# EAGLE design Lumen (EAGLE 7.4.0)
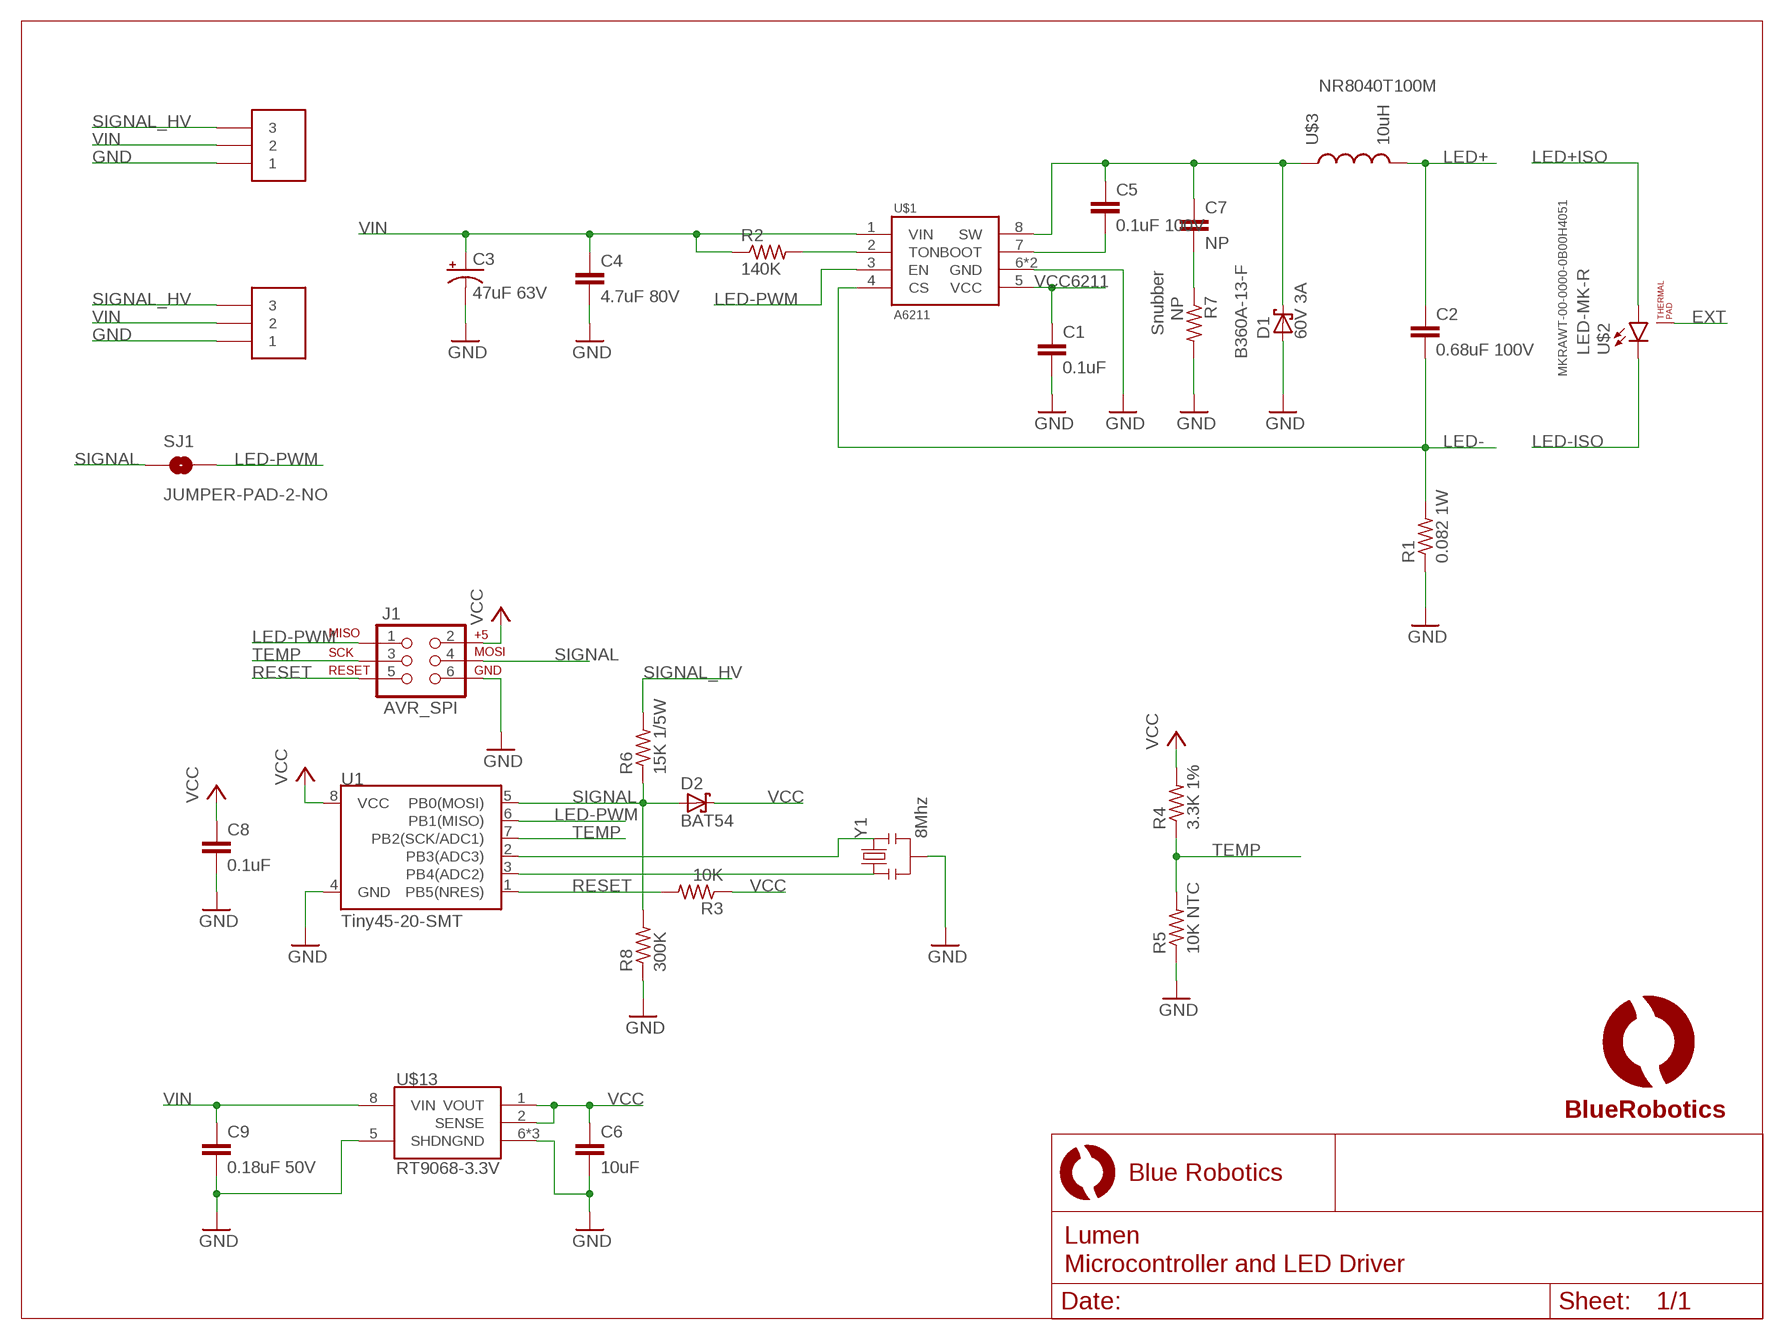
[diagram p0: schematic, sheet 1]

## Parts
C1  0.1uF  C-EUC0603  [C0603]
C2  0.68uF 100V  C-EUC0805  [C0805]
C3  47uF 63V  CAP_POLPTH1  [CPOL-RADIAL-100UF-25V]
C4  4.7uF 80V  C-EUC1210  [C1210]
C5  0.1uF 100V  C-EUC0805  [C0805]
C6  10uF  C-EUC0603  [C0603]
C7  NP  C-EUC0603  [C0603]
C8  0.1uF  C-EUC0603  [C0603]
C9  0.18uF 50V  C-EUC0805  [C0805]
D1  60V 3A  DIODE-SCHOTTKYSMA  [SMA]
D2  BAT54  DIODE-SCHOTTKYSOD523  [SOD523]
J1  AVR_SPI  AVR_SPI_PRG_6PTH  [2X3]
R1  0.082 1W  R-US_R2512  [R2512]
R2  140K  R-US_R0603  [R0603]
R3  10K  R-US_R0603  [R0603]
R4  3.3K 1%  R-US_R0603  [R0603]
R5  10K NTC  R-US_R0603  [R0603]
R6  15K 1/5W  RESISTOR_0402  [R0402]
R7  NP  R-US_R1206  [R1206]
R8  300K  RESISTOR_0402  [R0402]
SJ1  JUMPER-PAD-2-NO  [PAD-JUMPER-2-NO_NO_SILK]
U1  Tiny45-20-SMT  ATTINY45TINY45-20-SMT  [SO08-EIAJ]
U$1  A6211  [SOIC8N-LJ]
U$2  LED-MK-R  [MK-R]
U$3  10uH  INDUCTOR8040  [INDUCTOR-8040]
U$10  LOGOBR-LOGO-MS-COPPER  [BR-LOGO-MEDIUM-SMALL-COPPER]
U$11  009176003032006  HEADER-3AVX-9176  [AVX-9176-3POS]
U$12  009176003032006  HEADER-3AVX-9176  [AVX-9176-3POS]
U$13  RT9068-3.3V  VREG-RT9068SOP-8  [SOIC8N-LJ]
Y1  8Mhz  RESONATORSMD  [RESONATOR-SMD]

## Nets
EXT: U$2.EXP(THERMAL)
GND: C1.2 C3.2(-) C4.2 C6.2 C8.2 C9.2 D1.A J1.6 R1.1 R5.1 R7.2 R8.1 U1.4(GND) U$1.6(GND) U$1.PAD(GND) U$11.1 U$12.1 U$13.5(SHDN) U$13.6(GND) U$13.7(GND) U$13.PAD(GND) Y1.2
LED+: C2.1 U$3.P$2
LED+ISO: U$2.A
LED-: C2.2 R1.2 U$1.4(CS)
LED-ISO: U$2.C
LED-PWM: J1.1 SJ1.2 U1.6(PB1(MISO)) U$1.3(EN)
N$1: R2.2 U$1.2(TON)
N$2: C7.2 R7.1
N$4: C5.2 U$1.7(BOOT)
N$5: C5.1 C7.1 D1.C U$1.8(SW) U$3.P$1
N$6: U1.3(PB4(ADC2)) Y1.1
N$7: U1.2(PB3(ADC3)) Y1.3
RESET: J1.5 R3.2 U1.1(PB5(NRES))
SIGNAL: D2.A J1.4 R6.1 R8.2 SJ1.1 U1.5(PB0(MOSI))
SIGNAL_HV: R6.2 U$11.3 U$12.3
TEMP: J1.3 R4.1 R5.2 U1.7(PB2(SCK/ADC1))
VCC: C6.1 C8.1 D2.C J1.2 R3.1 R4.2 U1.8(VCC) U$13.1(VOUT) U$13.2(SENSE)
VCC6211: C1.1 U$1.5(VCC)
VIN: C3.1(+) C4.1 C9.1 R2.1 U$1.1(VIN) U$11.2 U$12.2 U$13.8(VIN)

## Notes on the sheet
- NR8040T100M
- Snubber
- B360A-13-F
- MKRAWT-00-0000-0B00H4051

## Library data of the parts
C1 C2 C4-C9 = resistor:C-EU: CAPACITOR, European symbol
C3 = SparkFun-Capacitors:CAP_POL: Capacitor Polarized These are standard SMD and PTH capacitors. Normally 10uF, 47uF, and 100uF in electrolytic and tantalum varieties. Always verify the external diameter of the through hole cap, it varies with capacity, voltage, and manufacturer. The EIA devices should be standard.
D1 D2 = BlueRobotics-Main:DIODE-SCHOTTKY
J1 = SparkFun-Connectors:AVR_SPI_PRG_6: AVR ISP 6 Pin This is the reduced ISP connector for AVR programming. Common on Arduino. This footprint will take up less PCB space and can be used with a 10-pin to 6-pin adapter such as SKU: BOB-08508 **Special note about "TEST_POINT" package. The stop mask is on the top side, so if you want your programming test points to be on the bottom of your board, make sure to place this package on the bottom side of the board. This also ensure that the orientation to program from the bottom side will be correct.
R1-R5 R7 = resistor:R-US_: RESISTOR, American symbol
R6 R8 = BlueRobotics-Main:RESISTOR
SJ1 = SparkFun-Passives:JUMPER-PAD-2-NO
U1 = SparkFun-DigitalIC:ATTINY45: Atmel 8-pin 2/4/8kB flash uC; PROD_ID: IC-08922
U$1 = BlueRobotics-Main:A6211
U$2 = BlueRobotics-Main:LED-MK-R
U$3 = BlueRobotics-Main:INDUCTOR
U$10 = BlueRobotics-Main:LOGO
U$11 U$12 = BlueRobotics-Main:HEADER-3
U$13 = BlueRobotics-Main:VREG-RT9068: RT9068 60V to 3.3V Regulator, 50mA
Y1 = SparkFun:RESONATOR: Resonator Small SMD resonator. This is the itty bitty 10/20MHz resonators with built in caps. CSTCE10M0G55 and CSTCE20M0V53. Footprint has been reviewed closely but hasn't been tested yet.

## Board
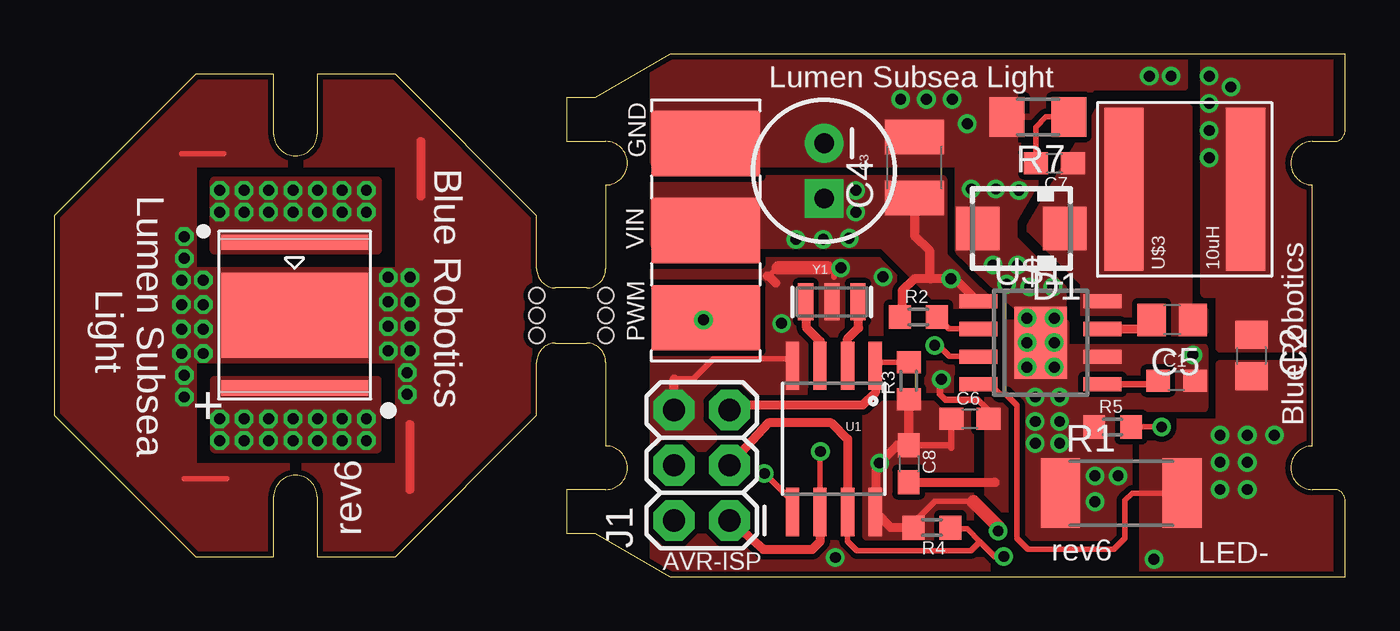
[diagram p1: board, top side]
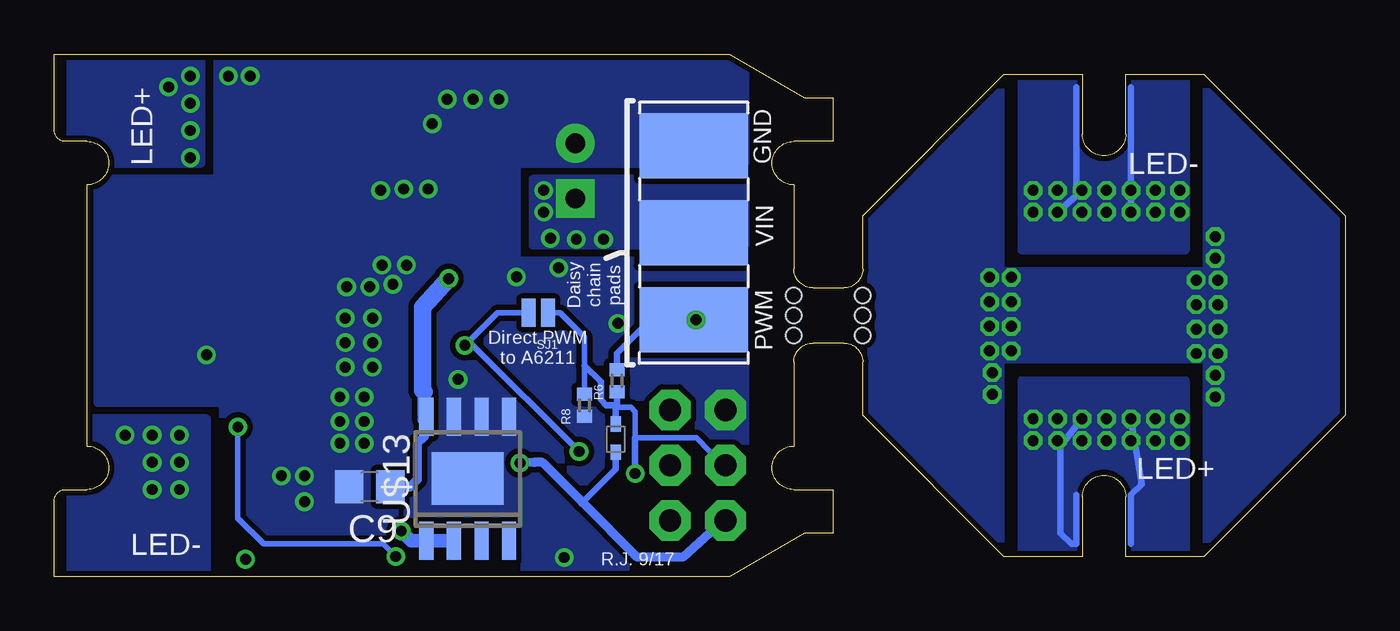
[diagram p2: board, bottom side, seen from below]

Size 59.35 x 24 mm. Coordinates in mm from the lower left corner, seen from the top.
Outline: 57.85,20 58.85,20 arc90 59.35,20.5 59.35,24 28.31,24 24.85,22 23.55,22 23.55,20 25.35,20 arc-180 25.35,18 25.35,14.15 arc-90 24.47,13.27 23.05,13.27 arc-90 22.17,14.15 22.17,16.59 15.68,23.09 12.09,23.09 12.09,20.34 arc-180 10.09,20.34 10.09,23.09 6.49,23.09 0,16.59 0,7.41 6.49,0.91 10.09,0.91 10.09,3.66 arc-180 12.09,3.66 12.09,0.91 15.68,0.91 22.17,7.41 22.17,9.85 arc-90 23.05,10.73 24.47,10.73 arc-90 25.35,9.85 25.35,6 arc-180 25.35,4 23.55,4 23.55,2 24.85,2 28.31,0 59.35,0 59.35,3.5 arc90 58.85,4 57.85,4 arc-180 57.85,6 57.85,18 arc-180 57.85,20
Copper layers (1*16): Top 0.0356mm / dielectric 1.5011mm / Bottom 0.0356mm
Design rules "OSHPark *": minimum track width 6mil, minimum drill 10mil, track to track 6mil, track to pad 6mil, pad to pad 6mil, via to via 6mil, smd to smd 6mil, copper to edge 10mil, drill to drill 6mil, minimum pad ring 7mil, minimum via ring 7mil, stop-mask expansion 3mil, vias tented up to drill 30mil, thermal gap 10mil
Holes 0.7 mm at 25.34,12.92 25.34,12 25.34,11.08 22.17,12.92 22.17,12 22.17,11.08

### Footprints (pad centres in the part's own frame; a part is rotated, then mirrored left to right if it is on the bottom)
C0603 = smd 1.1 x 1: 1 -0.85,0; 2 0.85,0
C0805 = smd 1.3 x 1.5: 1 -0.95,0; 2 0.95,0
CPOL-RADIAL-100UF-25V = drill 0.9 pad 1.778 square: 1 1.27,0 | drill 0.9 pad 1.778: 2 -1.27,0
C1210 = smd 1.6 x 2.7: 1 -1.4,0; 2 1.4,0
SMA = smd 2 x 2: A 2,0; C -2,0
SOD523 = smd 0.7 x 0.5: A 0.7,0; C -0.6,0
2X3 = drill 1.016 pad 1.88 octagon: 1 0,0; 2 0,2.54; 3 2.54,0; 4 2.54,2.54; 5 5.08,0; 6 5.08,2.54
R2512 = smd 1.8 x 3.2: 1 -2.8,0; 2 2.8,0
R0603 = smd 1 x 1.1: 1 -0.85,0; 2 0.85,0
R0402 = smd 0.6 x 0.7: 1 -0.5,0; 2 0.5,0
R1206 = smd 1.6 x 1.803: 1 -1.422,0; 2 1.422,0
PAD-JUMPER-2-NO_NO_SILK = smd 0.635 x 1.27: 1 -0.45,0; 2 0.45,0
SO08-EIAJ = smd 0.61 x 2.21: 1 -1.905,-3.378; 2 -0.635,-3.378; 3 0.635,-3.378; 4 1.905,-3.378; 5 1.905,3.353; 6 0.635,3.353; 7 -0.635,3.353; 8 -1.905,3.353
SOIC8N-LJ = smd 0.65 x 1.75: 1 -1.9,-2.86; 2 -0.63,-2.86; 3 0.64,-2.86; 4 1.91,-2.86; 5 1.91,2.84; 6 0.64,2.84; 7 -0.63,2.84; 8 -1.9,2.84 | smd 3.3 x 2.41: PAD 0,0
MK-R = smd 0.7 x 6.76: A 0,0; C 6.7,0 | smd 3.9 x 6.76: EXP 3.35,0
INDUCTOR-8040 = smd 1.8 x 7.5: P$1 -2.8,0; P$2 2.8,0
AVX-9176-3POS = smd 3 x 5: 1 0,0; 2 4,0; 3 8,0
RESONATOR-SMD = smd 0.7 x 1.7: 1 -1.2,0; 2 0,0; 3 1.2,0

### Placement (x,y rotation side)
C1  51.6,9 0 top
C2  55.04,10.16 270 top
C3  35.39,18.65 270 top
C4  39.55,18.8 90 top
C5  51.4,11.8 180 top
C6  42.1,7.25 0 top
C7  45.97,19 180 top
C8  39.29,5.19 270 top
C9  44.85,4.12 180 bottom
D1  44.46,15.99 180 top
D2  33.54,6.31 90 bottom
J1  31.04,2.58 90 top
R1  49.05,3.83 0 top
R2  39.73,11.93 0 top
R3  39.29,9 90 top
R4  40.35,2.25 180 top
R5  48.66,6.88 0 top
R6  33.47,9 90 bottom
R7  45.22,21.12 180 top
R8  34.97,7.88 90 bottom
SJ1  37.1,12.12 180 bottom
U1  35.84,6.32 180 top
U$1  45.35,10.75 270 top
U$2  11.05,15.37 270 top
U$3  51.97,17.8 0 top
U$10  49.97,12.75 90 bottom
U$11  29.95,19.9 270 top
U$12  29.95,19.8 270 bottom
U$13  40.35,4.5 0 bottom
Y1  35.75,12.62 0 top

### Tracks (layer width: path | path; a pad name or v marks a point on that pad's centre or on a via)
EXT  (via drill 0.5)
  Top 0.254: 7.91,4.5 5.97,4.5 | 7.79,19.44 5.85,19.44
  Top 0.406: 16.85,20 16.85,17.5 | 16.35,4 16.35,7
  other vias: 15.35,10.38 15.35,11.5 15.35,12.62 6.85,13.62 6.85,12.5 6.85,11.38 15.35,13.75 6.85,10.25 16.35,10.38 16.35,11.5 16.35,12.62 16.35,13.75 5.85,13.62 5.85,12.5 5.85,11.38 5.85,10.25 5.97,9.25 5.97,8.25 5.97,14.62 5.97,15.62 16.22,9.38 16.22,8.38
  pour Top (isolate 0.254, no thermals): 22.35,24 15.85,24 15.85,14 6.35,14 6.35,24 -2.15,24 -2.15,-1 6.35,-1 6.35,10 15.85,10 15.85,-1 22.35,-1
  pour Top (isolate 0.254, no thermals): 17.85,19 2.85,19 2.85,24 17.85,24
  pour Top (isolate 0.254, no thermals): 17.85,5 2.85,5 2.85,0 17.85,0
  pour Bottom (isolate 0.254, no thermals): 21.85,-1 15.85,-1 15.85,10 6.35,10 6.35,-1 -2.15,-1 -2.15,24 6.35,24 6.35,14 15.85,14 15.85,24 21.85,24
GND  (via drill 0.5)
  Top 0.254: 35.85,13.77 35.85,14 35.54,14.19 | 33.29,14.19 32.79,13.81 | 28.5,9.09 29.39,9.09 30.3,10 33.63,10 U1.4
  Top 0.305: C6.2 42.95,7.65 42.47,8.12 40.97,8.12 40.72,8.38 40.72,9 v40.79,9.06
  Top 0.406: J1.6 28.5,9.09 | 32.79,13.81 32.85,13.81 33.16,13.5 | C8.2 43.23,4.34 43.25,4.32
  Top 0.61: 35.54,14.19 33.29,14.19
  other vias: 38.91,21.94 41.97,20.81 40.1,21.94 41.29,21.94 42.16,17.81 43.29,17.81 38.1,13.77 47.85,3.44 52.35,10.19 44.85,13.31 45.91,13.31 47.85,4.62 35.91,0.88 36.16,14.19 48.91,4.62 46.22,6.12 44.35,17.75 50.35,23 51.35,23 44.72,9.62 44.72,10.75 44.72,11.88 45.97,11.88 45.97,10.75 45.97,9.62 46.22,8.25 46.22,7.12 44.29,14.31 43.16,14.31 43.79,13.44 45.1,8.25 45.1,7.12 45.1,6.12 33.43,11.64
  pour Top (isolate 0.254, no thermals): 27.6,25 44.1,25 44.1,19 27.6,19
  pour Top (isolate 0.254, no thermals): 41.6,20 41.6,15 44.35,12.38 46.35,10.25 46.35,13.25 44.1,15.5 44.1,20
  pour Bottom (isolate 0.254, no thermals): 27.6,19 27.6,25 51.85,25 51.85,18.25 57.35,18.25 57.35,8 51.6,8 51.6,-0.75 27.6,-0.75 27.6,14.5 38.1,14.5 38.1,19
  pour Top (isolate 0.254): 43.47,15.25 47.72,22.5 51.97,22.5 51.97,25 44.1,25
  pour Top (isolate 0.254, no thermals): 27.6,14.5 37.85,14.5 40.72,11.62 46.47,11.62 46.47,10.5 52.85,10.5 52.85,7.75 49.35,7.75 49.35,0 42.97,0 42.97,8.62 36.47,8.62 36.47,0 27.6,0
  pour Top (isolate 0.254, no thermals): 35.22,1.12 44.1,1.12 44.1,-0.62 35.22,-0.62
LED+  (via drill 0.5)
  other vias: 53.1,23 54.1,22.5 53.1,21.75 53.1,20.5 53.1,19.25
  pour Top (isolate 0.254, no thermals): 52.9,25 58.6,25 58.6,20 57.85,20 57.85,10.5 53.6,10.5 53.6,13 52.9,13
  pour Bottom (isolate 0.254, no thermals): 52.6,25 58.6,25 58.6,19 52.6,19
LED+ISO  (via drill 0.5)
  Bottom 0.305: 9.85,22.5 v9.85,16.75 | 12.35,22.5 12.35,17.5 v13.22,16.75
  other vias: 14.35,16.75 12.1,16.75 10.97,16.75 8.72,16.75 7.6,16.75 14.35,17.75 13.22,17.75 12.1,17.75 10.97,17.75 9.85,17.75 8.72,17.75 7.6,17.75
  pour Top (isolate 0.254, no thermals): 14.85,15 7.35,15 7.35,18.19 14.85,18.19
  pour Bottom (isolate 0.254, no thermals): 14.85,23.75 7.35,23.75 7.35,15 14.85,15
LED-  (via drill 0.5, 0.5 pad 0.25)
  Top 0.254: R1.2 49.56,3.83 49.22,3.5 49.22,1.75 48.72,1.25 44.76,1.25 44.26,1.75 44.26,7.88 43.76,8.38 43.47,8.38 43.01,8.84 U$1.4 | 42.47,8.82 U$1.4 | 42.6,8.73 U$1.4
  other vias: 54.85,4 53.6,4 53.6,5.25 53.6,6.5 54.85,6.5 54.85,5.25 56.1,6.5 50.56,0.79
  pour Bottom (isolate 0.254, no thermals): 58.6,-0.5 52.35,-0.5 52.35,7.25 58.6,7.25
  pour Top (isolate 0.254, no thermals): 53.6,9.75 58.6,9.75 58.6,-0.5 50.1,-0.5 50.1,7.06 53.6,7.06
LED-ISO  (via drill 0.5)
  Bottom 0.305: 12.35,3.75 12.35,1.5 12.6,1.5 13.1,2 13.1,6 v12.1,7.25 | 9.85,1.5 9.85,3.75 9.35,4.25 v9.85,7.25
  other vias: 14.35,7.25 13.22,7.25 10.97,7.25 8.72,7.25 7.6,7.25 7.6,6.25 8.72,6.25 9.85,6.25 10.97,6.25 12.1,6.25 13.22,6.25 14.35,6.25
  pour Top (isolate 0.254, no thermals): 14.85,9 7.35,9 7.35,5.88 14.85,5.88
  pour Bottom (isolate 0.254, no thermals): 7.35,9 7.35,-1 14.85,-1 14.85,9
LED-PWM  (via drill 0.5)
  Top 0.254: U1.6 35.2,5.83 v35.22,5.75 | v40.47,10.62 40.6,10.69 41.16,10.12 42.47,10.12 U$1.3
  Top 0.406: J1.1 31.36,2.33 32.6,1.25 34.85,1.25 35.22,1.62 35.22,2.95 U1.6
  Bottom 0.254: v35.22,5.75 40.16,10.69 40.79,10.69 v40.47,10.62 38.97,12.12 SJ1.2
N$1
  Top 0.254: U$1.2 41.13,11.38 R2.2
N$2
  Top 0.254: C7.2 45.12,20.65 45.6,21.12 R7.1
N$4
  Top 0.406: U$1.7 50.63,11.38 C5.2
N$5
  pour Top (isolate 0.254, no thermals): 52.85,11.25 52.85,12.25 52.15,12.25 52.15,21.5 48.1,21.5 44.85,16 47.35,13.5 47.35,11.25
N$6
  Top 0.406: U1.3 35.2,10.82 34.59,11.43 34.59,12.58 Y1.1
N$7
  Top 0.406: U1.2 36.47,10.93 36.97,11.43 36.97,12.6 Y1.3
RESET
  Top 0.254: R3.2 37.9,9.85 U1.1
  Top 0.406: U1.1 37.74,8.46 37.16,7.88 31.77,7.88 J1.5
SIGNAL  (via drill 0.5)
  Top 0.305: U1.5 33.93,3.45 v32.65,4.74
  Bottom 0.254: R8.2 34.97,9.69 34.97,11 36.1,12.12 SJ1.1 | 33.47,7.88 33.38,7.78 32.84,7.78 32.65,7.58 32.65,6.39 29.83,6.39 28.6,5.12 J1.4
  Bottom 0.305: R6.1 33.47,7.88 | 33.47,7.88 33.97,7.88 34.22,8.12 34.22,8.94 34.97,9.69 | D2.A 33.54,7.81 33.47,7.88 | v32.65,4.74 32.65,6.39
SIGNAL_HV  (via drill 0.5)
  Top 0.305: 29.55,11.5 v29.85,11.8 U$11.3
  Bottom 0.305: R6.2 33.47,10.28 31.95,11.8 U$12.3 v29.85,11.8 29.45,11.8
TEMP  (via drill 0.5)
  Top 0.254: v50.91,6.88 R5.2 | U1.7 36.47,1.62 36.91,1.19 42.15,1.19 42.56,1.6 | v43.66,0.92 43.25,0.92 42.56,1.6 | 42.56,1.6 41.97,2.2 41.25,2.2 R4.1
  Top 0.406: U1.7 36.47,6.31 35.72,7.06 32.82,7.06 J1.3
  Bottom 0.254: v50.91,6.88 50.91,2.69 49.72,1.5 44.23,1.5 v43.66,0.92
VCC  (via drill 0.5)
  Top 0.254: R4.2 39.5,2.48 40.48,3.45 42.24,3.45 42.27,3.43
  Top 0.305: C8.1 41.11,6.04 | C6.1 41.25,5.91
  Top 0.406: R3.1 C8.1 38.76,6.04 v37.94,5.22 37.79,5.06 37.79,3.01 U1.8 38.46,2.25 R4.2
  Top 0.61: v43.39,2.1 43.39,2.31 42.27,3.43
  Bottom 0.305: D2.C 33.54,4.94 35.07,3.41
  Bottom 0.406: J1.2 28.97,2.21 30.45,0.89 32.55,0.89 35.07,3.41 36.91,5.25 37.29,5.25 v37.94,5.22
  Bottom 0.61: U$13.2 U$13.1 42.94,1.64 v43.39,2.1
  pour Top (isolate 0.254, no thermals): 37.35,1.88 42.1,1.88 42.1,7.88 37.35,7.88
VCC6211
  Top 0.305: U$1.5 50.59,8.84 C1.1
VIN  (via drill 0.5, 0.5 pad 0.25)
  Top 0.305: v41.22,13.69 41.45,13.69 U$1.1
  Top 0.406: U$1.1 42.45,12.65 41.41,13.69 v41.22,13.69 40.29,13.69 | 40.29,13.69 39.54,13.69 38.97,13.12 38.97,12.03 R2.1 | C4.1 39.55,15.68 40.22,15 40.22,13.75 40.29,13.69
  Bottom 0.406: 42.35,7.24 42.35,6.43 42.67,6.12 42.67,4.46 43,4.12 C9.1
  Bottom 0.61: 42.35,8.5 42.35,7.44 U$13.8 42.35,7.24
  Bottom 0.813: v41.22,13.69 42.41,12.38 42.41,8.56 42.35,8.5
  other vias: 36.54,15.55 34.1,15.5 35.35,15.5 36.85,17.75 36.85,16.75
  pour Top (isolate 0.254, no thermals): 27.6,18.25 40.85,18.25 40.85,14.75 42.35,13.25 43.22,12.5 40.85,12.5 38.1,15.25 27.6,15.25
  pour Bottom (isolate 0.254, no thermals): 27.6,18.25 37.35,18.25 37.35,15.25 27.6,15.25

### Text on the board
tPlace: Lumen Subsea Light | Blue Robotics | GND | VIN | Lumen Subsea / Light | PWM | + | BlueRobotics | rev6 | rev6 | LED- | AVR-ISP
bPlace: GND | LED+ | LED- | VIN | PWM | Daisy / chain / pads | Direct PWM / to A6211 | LED+ | LED- | R.J. 9/17